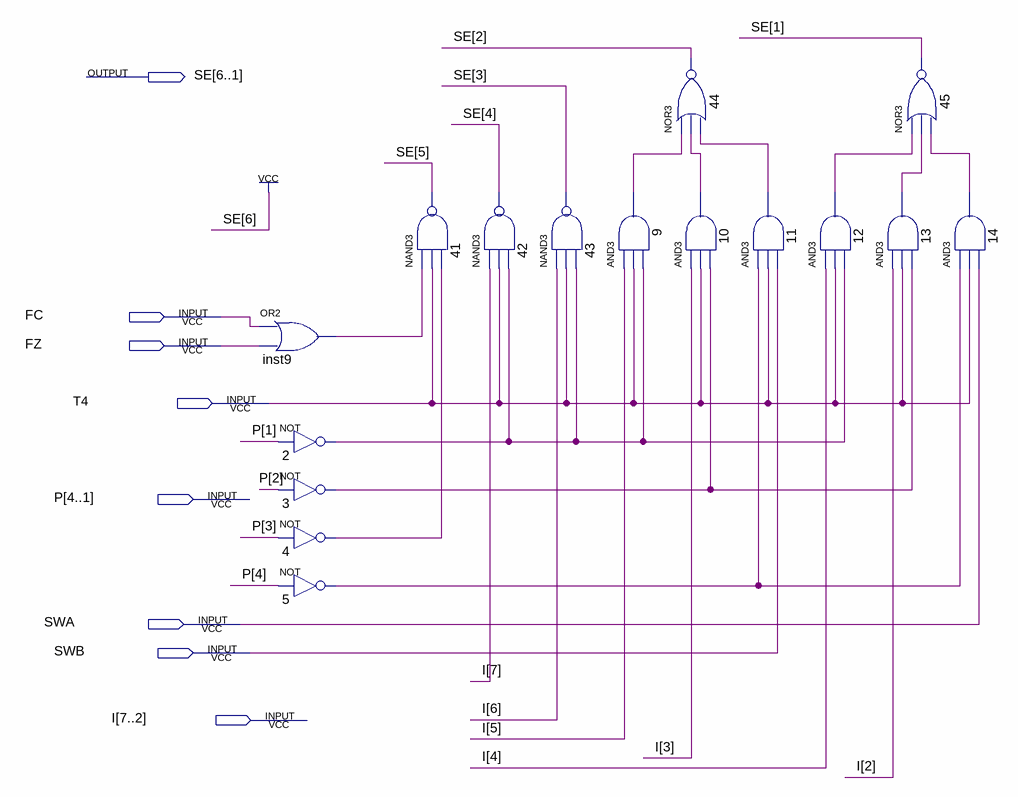
[diagram p0: schematic sheet]
// Quartus schematic control.bdf as structural Verilog: 16 symbols, 8 pins
module control (
  input  FC,
  input  FZ,
  input  T4,
  input  [4:1] P,
  input  SWA,
  input  SWB,
  input  [7:2] I,
  output [6:1] SE
);

  wire inst9_out, n2_out, n3_out, n4_out, n5_out, n9_out, n10_out, n11_out, n12_out, n13_out, n14_out;

  or inst9 (inst9_out, FC, FZ);
  not u_2 (n2_out, P[1]);
  not u_3 (n3_out, P[2]);
  not u_4 (n4_out, P[3]);
  not u_5 (n5_out, P[4]);
  nand u_41 (SE[5], inst9_out, T4, n4_out);
  nand u_42 (SE[4], I[7], T4, n2_out);
  nand u_43 (SE[3], I[6], T4, n2_out);
  and u_9 (n9_out, I[5], T4, n2_out);
  nor u_44 (SE[2], n9_out, n10_out, n11_out);
  and u_10 (n10_out, I[3], T4, n3_out);
  and u_11 (n11_out, n5_out, T4, SWB);
  and u_12 (n12_out, I[4], T4, n2_out);
  nor u_45 (SE[1], n12_out, n13_out, n14_out);
  and u_13 (n13_out, I[2], T4, n3_out);
  and u_14 (n14_out, n5_out, T4, SWA);

  assign SE[6] = 1'b1;
endmodule
